# EAGLE design esp8266 (EAGLE 7.1.0)

## Sheet 1 of 2
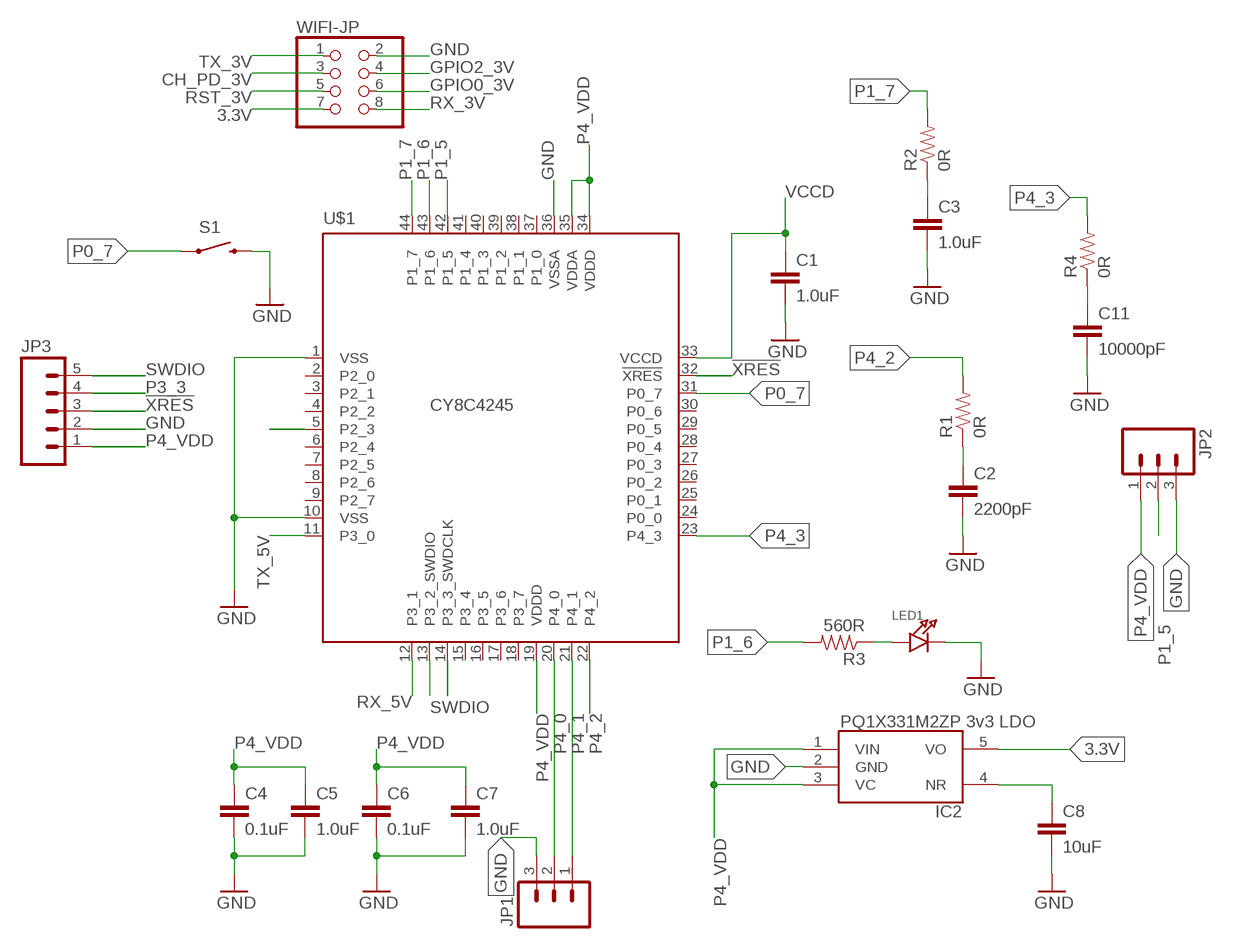
[diagram p0: schematic, sheet 1]

### Parts
C1  1.0uF  CAP0805  [0805]
C2  2200pF  CAP0805  [0805]
C3  1.0uF  CAP0805  [0805]
C4  0.1uF  CAP0805  [0805]
C5  1.0uF  CAP0805  [0805]
C6  0.1uF  CAP0805  [0805]
C7  1.0uF  CAP0805  [0805]
C8  10uF  CAP0805  [0805]
C11  10000pF  CAP0805  [0805]
IC2  PQ1X331M2ZP-3V3-LDO-SOT-23-5  [SOT-23-5]
JP1  M031X03_NO_SILK  [1X03_NO_SILK]
JP2  M031X03_NO_SILK  [1X03_NO_SILK]
JP3  M05PTH  [1X05]
LED1  LED0805  [CHIPLED_0805]
R1  0R  RESISTOR0805-RES  [0805]
R2  0R  RESISTOR0805-RES  [0805]
R3  560R  RESISTOR0805-RES  [0805]
R4  0R  RESISTOR0805-RES  [0805]
S1  SPARKFUN_SWITCH-MOMENTARY-2SMD  [SPARKFUN_TACTILE_SWITCH_SMD]
U$1  CY8C4245  CY8C4245AXI-483  [TQFP44]
WIFI-JP  PINHD-2X4  [2X04]

### Nets
3.3V: IC2.5(VO) WIFI-JP.7 ; also sheet 2
!XRES: JP3.3 U$1.32(!XRES)
CH_PD_3V: WIFI-JP.3 ; also sheet 2
CH_PD_5V: U$1.5(P2_3) ; also sheet 2
GND: C1.2 C2.2 C3.2 C4.2 C5.2 C6.2 C7.2 C8.2 C11.2 IC2.2(GND) JP1.3 JP2.3 JP3.2 LED1.C S1.3 U$1.1(VSS) U$1.10(VSS) U$1.36(VSSA) WIFI-JP.2
GPIO0_3V: WIFI-JP.6
GPIO2_3V: WIFI-JP.4
N$4: C2.1 R1.1
N$5: C3.1 R2.1
N$8: C11.1 R4.1
N$9: LED1.A R3.1
N$14: C8.1 IC2.4(NR)
P0_7: S1.1 U$1.31(P0_7)
P1_5: JP2.2 U$1.42(P1_5)
P1_6: R3.2 U$1.43(P1_6)
P1_7: R2.2 U$1.44(P1_7)
P3_3: JP3.4 U$1.14(P3_3_SWDCLK)
P4_0: JP1.2 U$1.20(P4_0)
P4_1: JP1.1 U$1.21(P4_1)
P4_2: R1.2 U$1.22(P4_2)
P4_3: R4.2 U$1.23(P4_3)
P4_VDD: C4.1 C5.1 C6.1 C7.1 IC2.1(VIN) IC2.3(VC) JP2.1 JP3.1 U$1.19(VDDD) U$1.34(VDDD) U$1.35(VDDA) ; also sheet 2
RST_3V: WIFI-JP.5
RX_3V: WIFI-JP.8 ; also sheet 2
RX_5V: U$1.12(P3_1) ; also sheet 2
SWDIO: JP3.5 U$1.13(P3_2_SWDIO)
TX_3V: WIFI-JP.1 ; also sheet 2
TX_5V: U$1.11(P3_0) ; also sheet 2
VCCD: C1.1 U$1.33(VCCD)
Unconnected: U$1.2(P2_0) U$1.3(P2_1) U$1.4(P2_2) U$1.6(P2_4) U$1.7(P2_5) U$1.8(P2_6) U$1.9(P2_7) U$1.15(P3_4) U$1.16(P3_5) U$1.17(P3_6) U$1.18(P3_7) U$1.24(P0_0) U$1.25(P0_1) U$1.26(P0_2) U$1.27(P0_3) U$1.28(P0_4) U$1.29(P0_5) U$1.30(P0_6) U$1.37(P1_0) U$1.38(P1_1) U$1.39(P1_2) U$1.40(P1_3) U$1.41(P1_4)

## Sheet 2 of 2
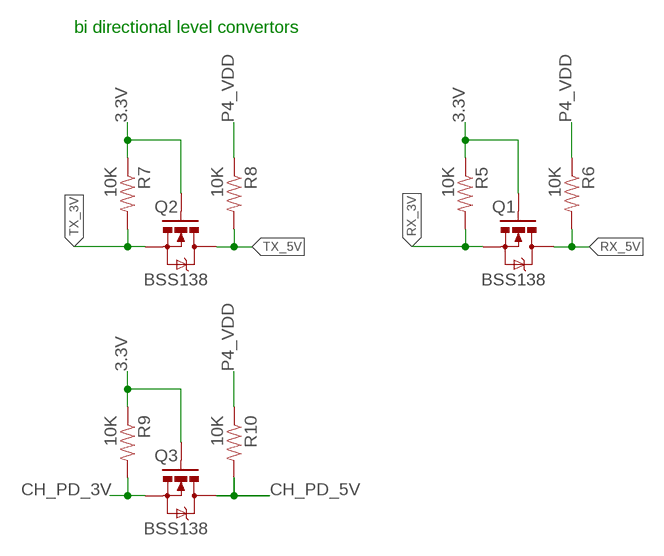
[diagram p1: schematic, sheet 2]

### Parts
Q1  BSS138  MOSFET-NCHANNELSMD  [SOT23-3]
Q2  BSS138  MOSFET-NCHANNELSMD  [SOT23-3]
Q3  BSS138  MOSFET-NCHANNELSMD  [SOT23-3]
R5  10K  RESISTOR0805-RES  [0805]
R6  10K  RESISTOR0805-RES  [0805]
R7  10K  RESISTOR0805-RES  [0805]
R8  10K  RESISTOR0805-RES  [0805]
R9  10K  RESISTOR0603-RES  [0603-RES]
R10  10K  RESISTOR0805-RES  [0805]

### Nets
3.3V: Q1.1(G) Q2.1(G) Q3.1(G) R5.1 R7.1 R9.1 ; also sheet 1
CH_PD_3V: Q3.2(S) R9.2 ; also sheet 1
CH_PD_5V: Q3.3(D) R10.2 ; also sheet 1
P4_VDD: R6.1 R8.1 R10.1 ; also sheet 1
RX_3V: Q1.2(S) R5.2 ; also sheet 1
RX_5V: Q1.3(D) R6.2 ; also sheet 1
TX_3V: Q2.2(S) R7.2 ; also sheet 1
TX_5V: Q2.3(D) R8.2 ; also sheet 1

### Notes on the sheet
- bi directional level convertors

## Library data of the parts
C1-C8 C11 = SparkFun-Capacitors:CAP: Capacitor Standard 0603 ceramic capacitor, and 0.1" leaded capacitor.
IC2 = STM32-PROX:PQ1X331M2ZP-3V3-LDO-SOT-23-5
JP1 JP2 = SparkFun-Connectors:M03: Header 3 Standard 3-pin 0.1" header. Use with straight break away headers (SKU : PRT-00116), right angle break away headers (PRT-00553), swiss pins (PRT-00743), machine pins (PRT-00117), and female headers (PRT-00115). Molex polarized connector foot print use with SKU : PRT-08232 with associated crimp pins and housings.
JP3 = SparkFun-Connectors:M05: Header 5 Standard 5-pin 0.1" header. Use with straight break away headers (SKU : PRT-00116), right angle break away headers (PRT-00553), swiss pins (PRT-00743), machine pins (PRT-00117), and female headers (PRT-00115). Molex polarized connector foot print use with SKU : PRT-08230 with associated crimp pins and housings.
LED1 = microbuilder:LED: LED 0603 - 0603 Surface Mount Package Green LED - Low Power (3.9mcd, 2ma, 1.7Vf) Orange LED - Low Power (9.8mcd, 2ma, 1.8Vf) Red LED - Low Power (5mcd, 2ma, 1.8Vf) Yellow LED - Low Power (7mcd, 2ma, 1.8Vf) 0805 - 0805 Surface Mount Package 20mA: Red LED (104mcd, 20mA, Diffused) - LS R976 [Digikey: 475-1278-6-ND] Red LED (12mcd, 20mA, 2.0Vf, Clear) - APT2012EC [Digikey: 754-1128-1-ND] Green LED (15mcd, 20mA, 2.2Vf, Clear) - APT2012GC [Digikey: 754-1131-1-ND] Orange LED (160mcd, 20mA, 2.1Vf, Clear) - APT2012SECK [Digikey: 754-1130-1-ND] 2mA: Red LED (8.8mcd, 2mA, 1.8Vf, Clear) - Low Power [Digikey: 475-2510-1-ND] Green LED (5mcd, 2mA, 1.8Vf, Clear) - Low Power [Digikey: 475-2730-1-ND] Yellow LED (11.3mcd, 2mA, 1.8Vf, Clear) - Low Power [Digikey: 475-2555-1-ND] 1206 - 1206 Surface Mount Package Green LED (26mcd, 20mA, Diffused) - LG N971 [Digikey: 475-1407-6-ND] Red LED (15mcd, 20mA, Diffused) - LH N974 [Digikey: 475-1416-6-ND]
Q1-Q3 = SparkFun:MOSFET-NCHANNEL
R1-R4 = SparkFun-Resistors:RESISTOR: Resistor Basic schematic elements and footprints for 0603, 1206, and PTH resistors.
R5-R10 = SparkFun:RESISTOR: Resistor Basic schematic elements and footprints for 0603, 1206, and PTH resistors.
S1 = Nullspace:SPARKFUN_SWITCH-MOMENTARY-2
U$1 = cypress:CY8C4245AXI-483
WIFI-JP = pinhead:PINHD-2X4: PIN HEADER

## Net classes
0 default: width 0.203 mm

## Board
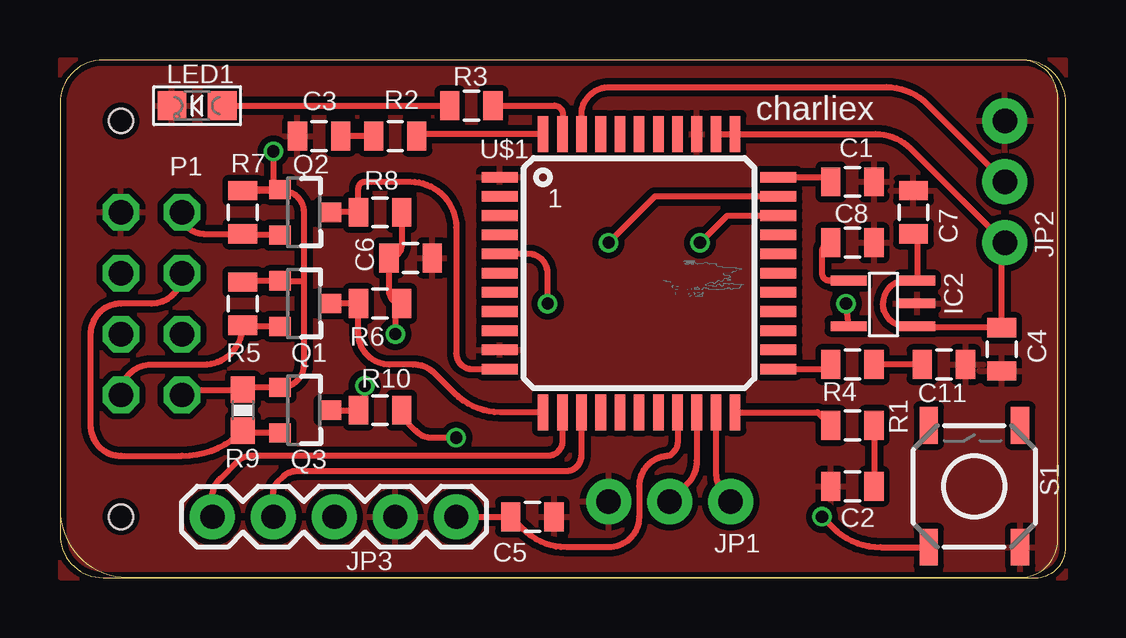
[diagram p2: board, top side]
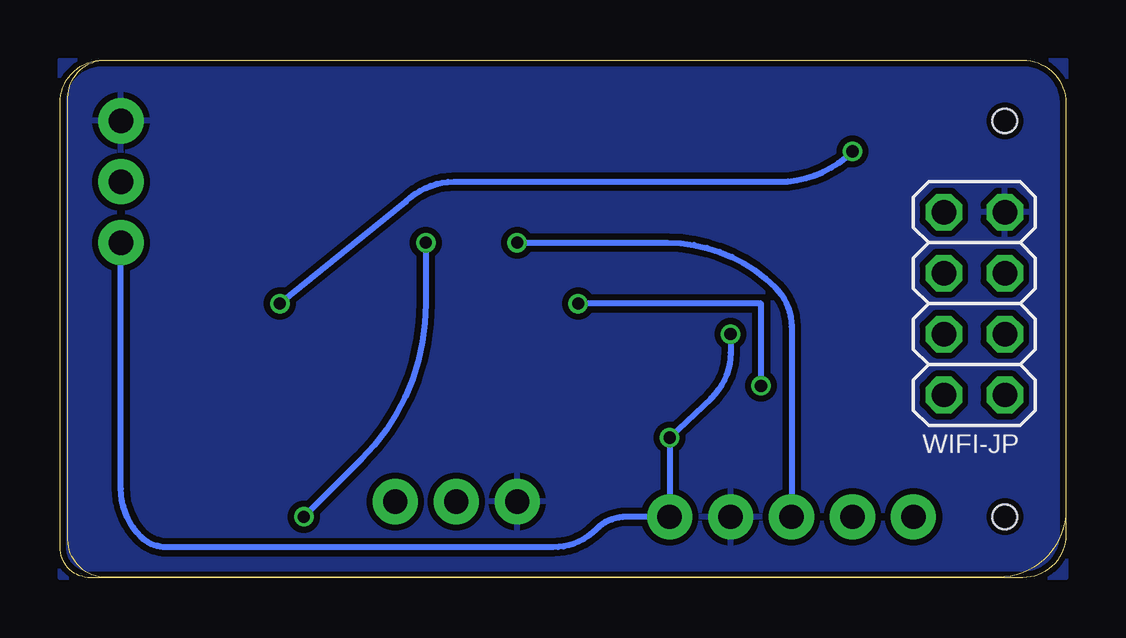
[diagram p3: board, bottom side, seen from below]

Size 41.91 x 21.59 mm. Coordinates in mm from the lower left corner, seen from the top.
Outline: 41.91,1.27 41.91,19.79 arc90 40.11,21.59 1.8,21.59 arc90 0,19.79 0,1.8 arc90 1.8,0 40.64,0 arc90 41.91,1.27
Copper layers (1*16): Top 0.035mm / dielectric 1.5mm / Bottom 0.035mm
Design rules "ITEADstudio_DRC": minimum track width 6mil, minimum drill 12mil, track to track 6mil, track to pad 6mil, pad to pad 6mil, via to via 6mil, smd to smd 0mil, copper to edge 10mil, drill to drill 10mil, minimum pad ring 10mil, minimum via ring 6mil, stop-mask expansion 2mil, vias tented up to drill 100mil, thermal gap 10mil
Holes 1.02 mm at 2.54,2.54 2.54,19.05
Milling: 8 lines

### Footprints (pad centres in the part's own frame; a part is rotated, then mirrored left to right if it is on the bottom)
0805 = smd 0.8 x 1.2: 1 -0.9,0; 2 0.9,0
SOT-23-5 = smd 0.4 x 1.5: 1 -0.94,-1.422; 2 0.01,-1.422; 3 0.96,-1.422; 4 0.96,1.428; 5 -0.94,1.428
1X03_NO_SILK = drill 1.016 pad 1.88: 1 0,0; 2 2.54,0; 3 5.08,0
1X05 = drill 1.016 pad 1.88: 1 0,0; 2 2.54,0; 3 5.08,0; 4 7.62,0; 5 10.16,0
CHIPLED_0805 = smd 1.2 x 1.2: A 0,-1.05; C 0,1.05
SOT23-3 = smd 0.8 x 0.9: 1 -0.95,-1; 2 0.95,-1; 3 0,1.1
0603-RES = smd 1.1 x 1: 1 -0.85,0; 2 0.85,0
SPARKFUN_TACTILE_SWITCH_SMD = smd 1.524 x 0.762: 1 -2.54,1.905; 2 2.54,1.905; 3 -2.54,-1.905; 4 2.54,-1.905
TQFP44 = smd 1.5 x 0.44: 1 -5.8,4; 2 -5.8,3.2; 3 -5.8,2.4; 4 -5.8,1.6; 5 -5.8,0.8; 6 -5.8,0; 7 -5.8,-0.8; 8 -5.8,-1.6; 9 -5.8,-2.4; 10 -5.8,-3.2; 11 -5.8,-4; 23 5.8,-4; 24 5.8,-3.2; 25 5.8,-2.4; 26 5.8,-1.6; 27 5.8,-0.8; 28 5.8,0; 29 5.8,0.8; 30 5.8,1.6; 31 5.8,2.4; 32 5.8,3.2; 33 5.8,4 | smd 0.44 x 1.5: 12 -4,-5.8; 13 -3.2,-5.8; 14 -2.4,-5.8; 15 -1.6,-5.8; 16 -0.8,-5.8; 17 0,-5.8; 18 0.8,-5.8; 19 1.6,-5.8; 20 2.4,-5.8; 21 3.2,-5.8; 22 4,-5.8; 34 4,5.8; 35 3.2,5.8; 36 2.4,5.8; 37 1.6,5.8; 38 0.8,5.8; 39 0,5.8; 40 -0.8,5.8; 41 -1.6,5.8; 42 -2.4,5.8; 43 -3.2,5.8; 44 -4,5.8
2X04 = drill 1.016 octagon: 1 -3.81,-1.27; 2 -3.81,1.27; 3 -1.27,-1.27; 4 -1.27,1.27; 5 1.27,-1.27; 6 1.27,1.27; 7 3.81,-1.27; 8 3.81,1.27

### Placement (x,y rotation side)
C1  33.02,16.51 0 top
C2  33.02,3.81 180 top
C3  10.79,18.41 180 top
C4  39.24,9.53 270 top
C5  19.68,2.54 0 top
C6  14.61,13.33 0 top
C7  35.56,15.24 90 top
C8  33.02,13.97 0 top
C11  36.83,8.89 0 top
IC2  34.29,11.43 90 top
JP1  27.94,3.17 180 top
JP2  39.37,13.97 90 top
JP3  16.51,2.54 180 top
LED1  5.71,19.69 90 top
Q1  10.16,11.43 270 top
Q2  10.16,15.24 270 top
Q3  10.16,6.98 270 top
R1  33.02,6.35 180 top
R2  13.97,18.41 0 top
R3  17.14,19.69 0 top
R4  33.02,8.89 180 top
R5  7.62,11.43 270 top
R6  13.34,11.43 180 top
R7  7.62,15.24 270 top
R8  13.34,15.24 180 top
R9  7.62,6.98 270 top
R10  13.34,6.98 180 top
S1  38.1,3.81 90 top
U$1  24.13,12.7 0 top
WIFI-JP  3.81,11.43 270 bottom

### Tracks (layer width: path | path; a pad name or v marks a point on that pad's centre or on a via)
3.3V  (via drill 0.51)
  Top 0.254: R5.1 7.67,12.38 Q1.1 10.16,12.38 | R9.1 7.72,7.93 Q3.1 9.21,7.93 arc90 10.16,8.89 10.16,12.38 | 10.16,12.38 10.16,15.24 arc90 9.26,16.14 R7.1 7.67,16.19 Q2.1 8.89,16.46 v8.89,17.78 | IC2.5 v32.75,11.43 | R9.1 7.62,7.62 | WIFI-JP.7 5.08,7.83 R9.1
  Bottom 0.254: v32.75,11.43 27.5,15.68 arc45 25.49,16.51 11.96,16.51 arc-45 v8.89,17.78
!XRES  (via drill 0.51)
  Top 0.254: U$1.32 24.79,15.9 v22.86,13.97
  Bottom 0.254: v22.86,13.97 16.6,13.97 arc45 12.11,12.11 arc45 11.43,10.47 JP3.3
CH_PD_3V
  Top 0.254: Q3.2 7.72,6.04 R9.2 | R9.2 7.41,6.13 | WIFI-JP.3 arc-90 3.81,11.43 2.54,11.43 arc90 1.27,10.16 1.27,6.35 arc90 2.54,5.08 5.08,5.08 arc45 R9.2
CH_PD_5V  (via drill 0.51)
  Top 0.254: Q3.3 R10.2 arc90 12.7,7.25 v12.7,8 | v20.32,11.43 20.32,12.7 arc90 19.52,13.5 U$1.5
  Bottom 0.254: v12.7,8 12.7,11.43 v20.32,11.43
GND
  pour Top (isolate 0.254): 41.91,21.59 0,21.59 0,0 41.91,0
  pour Bottom (isolate 0.254): 41.91,21.59 0,21.59 0,0 41.91,0
N$4
  Top 0.254: R1.1 C2.1
N$5
  Top 0.254: R2.1 C3.1
N$8
  Top 0.254: C11.1 R4.1
N$9
  Top 0.254: LED1.A R3.1
N$14
  Top 0.254: IC2.4 32.06,12.39 arc-90 31.75,12.7 31.75,13.6 arc-90 C8.1
P0_7  (via drill 0.51)
  Top 0.254: v26.67,13.97 27.8,15.1 U$1.31 | v31.75,2.54 32.19,2.1 arc45 34.2,1.27 S1.1
  Bottom 0.254: v26.67,13.97 26.67,11.41 arc45 29.35,4.94 v31.75,2.54
P1_5
  Top 0.254: U$1.42 21.73,19.42 arc-90 23.02,20.45 34.22,20.45 arc-45 36,19.88 JP2.2
P1_6
  Top 0.254: R3.2 20.6,19.69 arc-90 20.96,19.33 20.96,18.52 U$1.43
P1_7
  Top 0.254: U$1.44 14.96,18.5 R2.2
P3_3
  Top 0.254: JP3.4 8.89,3.57 arc-45 9.06,3.98 9.31,4.23 arc-45 9.82,4.44 21.08,4.44 arc90 21.73,5.09 U$1.14
P4_0
  Top 0.254: U$1.20 26.53,4.87 arc-45 26.13,3.9 JP1.2
P4_1
  Top 0.254: U$1.21 27.33,4.38 arc45 27.75,3.37 JP1.1
P4_2
  Top 0.254: U$1.22 31.57,6.9 R1.2
P4_3
  Top 0.254: U$1.23 31.93,8.7 arc90 R4.2
P4_VDD  (via drill 0.51)
  Top 0.254: U$1.35 U$1.34 33.98,18.5 arc-45 35.45,17.89 JP2.1 arc90 39.24,13.84 C4.1 35.78,10.43 arc-90 IC2.1 35.23,10.49 arc-90 34.29,11.43 arc-90 35.25,12.39 IC2.3 35.71,14.19 C7.1 | R8.1 14.23,13.87 arc-90 C6.1 13.71,11.96 arc90 R6.1 13.97,11.43 v13.97,10.16 | JP3.1 C5.1 19.32,2.01 arc45 21.1,1.27 22.86,1.27 arc90 24.13,2.54 24.13,3.81 arc-90 25.4,5.08 25.59,5.27 arc45 25.73,5.6 U$1.19 | R10.1 14.23,6.72 14.82,6.13 arc45 15.45,5.84 v16.51,5.84
  Bottom 0.254: JP2.1 39.37,3.72 arc-45 38.54,1.71 arc-45 37.48,1.27 21.37,1.27 arc-45 19.58,2.01 arc45 18.31,2.54 JP3.1 v16.51,5.84 14.79,7.48 arc-46 13.97,9.38 v13.97,10.16
RX_3V
  Top 0.254: Q1.2 7.67,10.48 R5.2 arc-90 5.98,8.89 3.81,8.89 arc90 WIFI-JP.8
RX_5V
  Top 0.254: Q1.3 R6.2 12.44,10.19 arc90 13.73,8.89 14.71,8.89 arc-45 15.61,8.52 16.44,7.69 arc45 18.35,6.9 U$1.12
SWDIO
  Top 0.254: JP3.5 6.35,3.36 arc-45 6.67,4.13 7.41,4.87 arc-45 7.92,5.08 20.32,5.08 arc90 20.93,5.69 U$1.13
TX_3V
  Top 0.254: Q2.2 7.67,14.29 R7.2 5.98,14.34 arc-90 WIFI-JP.1
TX_5V
  Top 0.254: Q2.3 R8.2 12.44,16.25 arc-90 12.7,16.51 14.61,16.51 arc-90 16.51,14.61 16.51,9.37 arc90 17.18,8.7 U$1.11
VCCD
  Top 0.254: U$1.33 31.93,16.7 arc-90 C1.1

### Text on the board
tNames: charliex | P1 | 1